# Altium schematic sheet Audio.SchDoc
size B; Organization: ORGANIZATION; Address1: ADDRESS 1; Address2: ADDRESS 2; Address3: ADDRESS 3; Address4: ADDRESS 4; Revision: -; SheetNumber: 4; SheetTotal: 7; ENG_APP_DATE: --/--/--; DSN_APP_DATE: --/--/--; CHK_APP_DATE: --/--/--
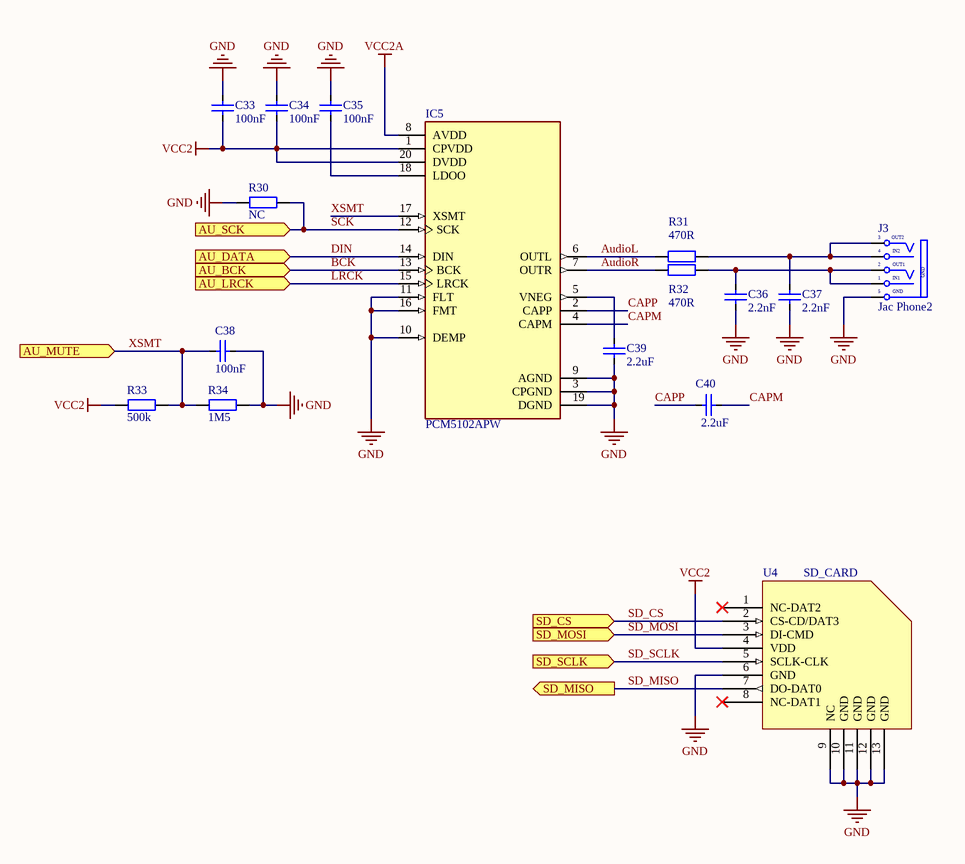
[diagram p0: Audio.SchDoc]

## Parts
C33  100nF  [CAP_0603]
C34  100nF  [CAP_0603]
C35  100nF  [CAP_0603]
C36  2.2nF  [CAP_0603]
C37  2.2nF  [CAP_0603]
C38  100nF  [CAP_0603]
C39  2.2uF  [CAP_0603]
C40  2.2uF  [CAP_0603]
IC5  PCM5102APW  [TSSOP-20]
J3  Jac Phone2  [JacPhone2]
R30  NC  [RES-SMD-0603]
R31  470R  [RES-SMD-0603]
R32  470R  [RES-SMD-0603]
R33  500k  [RES-SMD-0603]
R34  1M5  [RES-SMD-0603]
U4  SD_CARD  [MICROSD2]

## Ports
AU_BCK (in), AU_DATA (in), AU_LRCK (in), AU_MUTE (in), AU_SCK (in), SD_CS (in), SD_MISO (out), SD_MOSI (in), SD_SCLK (in)

## Nets
GND: C33.1 C34.1 C35.1 C36.1 C37.1 C38.2 C39.1 IC5.3(CPGND) IC5.9(AGND) IC5.10(DEMP) IC5.11(FLT) IC5.16(FMT) IC5.19(DGND) J3.5(GND) R30.1 R34.2 U4.6(GND) U4.9(NC) U4.10(GND) U4.11(GND) U4.12(GND) U4.13(GND)
VCC2: C33.2 C34.2 IC5.1(CPVDD) IC5.20(DVDD) R33.1 U4.4(VDD)
VCC2A: IC5.8(AVDD)
AudioL: IC5.6(OUTL) R31.2
AudioR: IC5.7(OUTR) R32.2
BCK: IC5.13(BCK) ; port AU_BCK
CAPM: C40.2 IC5.4(CAPM)
CAPP: C40.1 IC5.2(CAPP)
DIN: IC5.14(DIN) ; port AU_DATA
LRCK: IC5.15(LRCK) ; port AU_LRCK
SCK: IC5.12(SCK) R30.2 ; port AU_SCK
SD_CS: U4.2(CS-CD/DAT3) ; port SD_CS
SD_MISO: U4.7(DO-DAT0) ; port SD_MISO
SD_MOSI: U4.3(DI-CMD) ; port SD_MOSI
SD_SCLK: U4.5(SCLK-CLK) ; port SD_SCLK
XSMT: C38.1 IC5.17(XSMT) R33.2 R34.1 ; port AU_MUTE
NetC35_2: C35.2 IC5.18(LDOO)
NetC36_2: C36.2 J3.1(S1) J3.2(S1) R32.1
NetC37_2: C37.2 J3.3(TN) J3.4(S) R31.1
NetC39_2: C39.2 IC5.5(VNEG)

Not connected (* = marked no-connect by the designer): U4 1(NC-DAT2)* 8(NC-DAT1)*

## Notes on the sheet
- DWG. NO.
- REV.
- SHT.
- THIS DOCUMENT AND THE DATA DISCLOSED HEREIN OR HEREWITH IS THE PROPERTY OF ALTIUM LIMITED AND MAY BE FREELY DISTRIBUTED IN WHOLE. NO RIGHTS ARE RESERVED OR EXPRESS OR IMPLIED WARANTEE GIVEN.
- REVISION
- DESCRIPTION
- DATE
- APPROVED
- ENG:
- APPROVALS
- PROJECT
- DSN:
- CHK:
- REFERENCE DOCUMENTS
- PROJECT REVISION:
- TITLE
- DOCUMENT REVISION:
- DESIGN ITEM:
- BOM:
- FAB DWG:
- PCB DWG:
- ASSY DWG:
- SCALE:
- SIZE
- B
- CAGE CODE
- FILE NAME
- DWG NO.
- SHEET
- OF
- REV
- (in symbol Jac Phone2) OUT2; IN2; OUT1; IN1

## Library data of the parts
C33-C40 = CapSMD: Capacitor; Value: 33p; Published: 8-Jun-2000; LatestRevisionDate: 17-Jul-2002; LatestRevisionNote: Re-released for DXP Platform.; PackageReference: RAD-0.3; Publisher: Altium Limited
IC5 = PCM5102APW: Audio decode
J3 = Jac Phone2: Jac Phone Stereo; Creat by: VanDungEvn@Gmail.com
R30-R34 = Resistor - SMD: Resistor SMD; Manufacturer: Generic Components; Class: Passive; Published: 08/06/2000; Publisher: Altium Hobart Technology Centre
U4 = MicroSD: SD/MMC holder; Name: SD/MMC; Price: 10000